# Altium schematic sheet Buttons.SchDoc
size A4; Subtitle: Subtitle; Project: Project; VersionRevision: VersionRevision; TotalSheet: TotalSheet; SheetNumber: 7; SheetTotal: 9
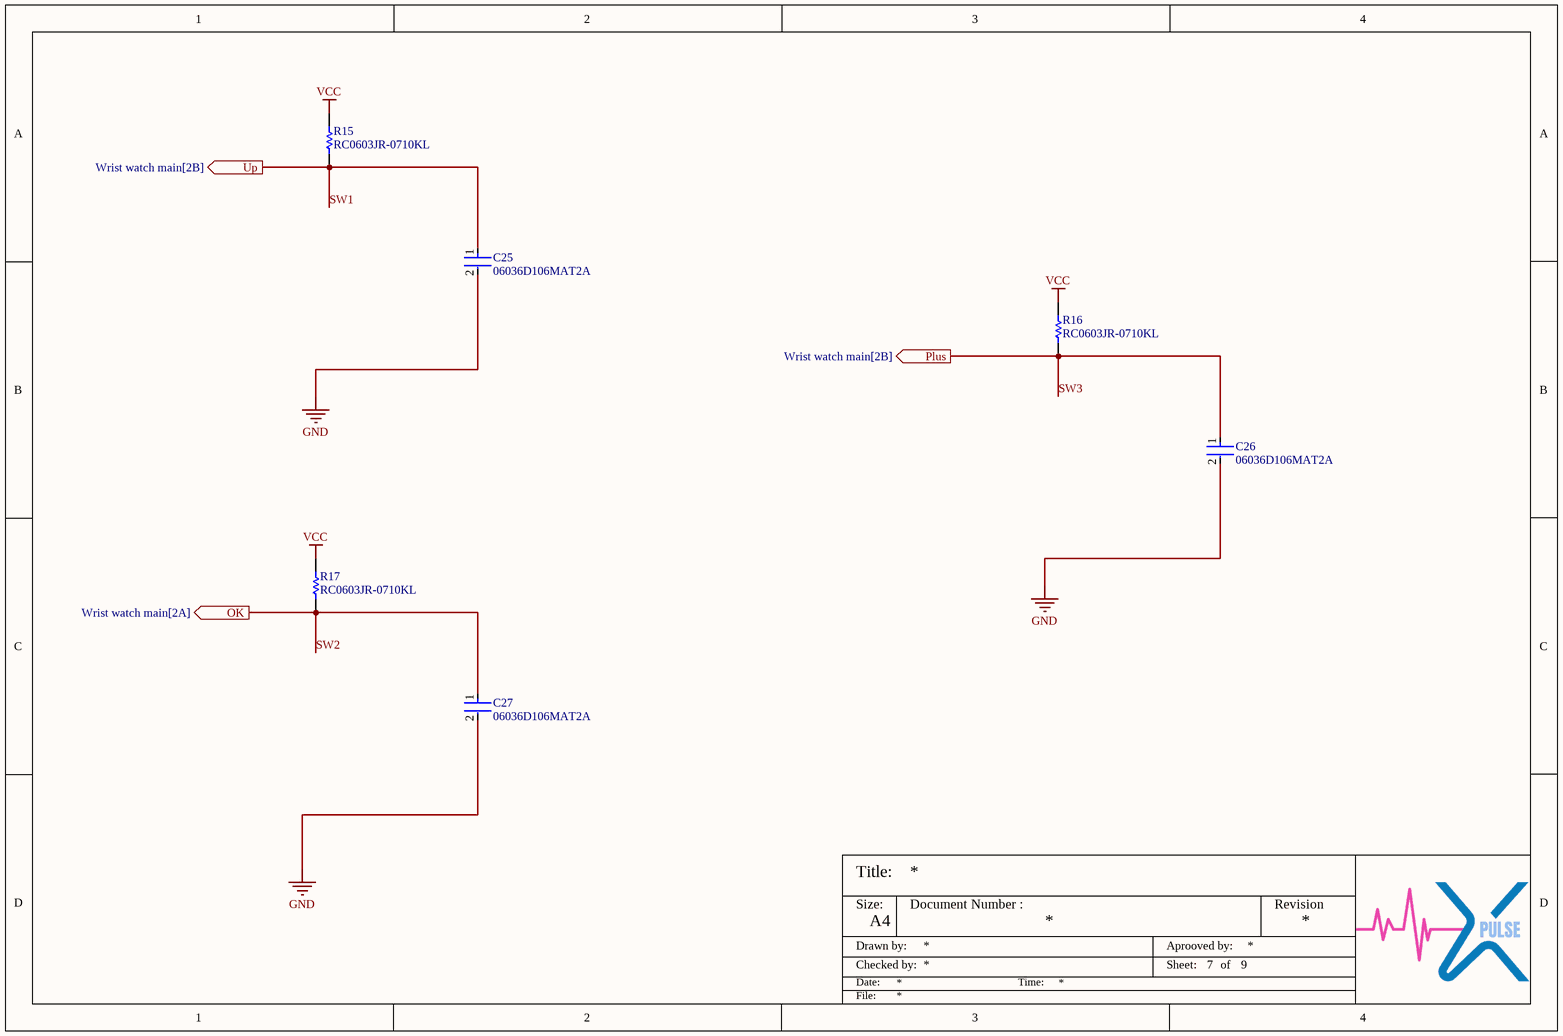
[diagram p0: Buttons.SchDoc]

## Parts
C25  06036D106MAT2A  [FP-0603-L_1_6_0_15-W_0_81-IPC_B]
C26  06036D106MAT2A  [FP-0603-L_1_6_0_15-W_0_81-IPC_B]
C27  06036D106MAT2A  [FP-0603-L_1_6_0_15-W_0_81-IPC_B]
R15  RC0603JR-0710KL  [RESC1608X55X25ML10T15]
R16  RC0603JR-0710KL  [RESC1608X55X25ML10T15]
R17  RC0603JR-0710KL  [RESC1608X55X25ML10T15]

## Ports
OK (out, see Wrist watch main[2A]), Plus (out, see Wrist watch main[2B]), Up (out, see Wrist watch main[2B])

## Nets
GND: C25.2 C26.2 C27.2
VCC: R15.2 R16.2 R17.2
SW1: C25.1 R15.1 ; port Up
SW2: C27.1 R17.1 ; port OK
SW3: C26.1 R16.1 ; port Plus

## Notes on the sheet
- Title:
- Size:
- Document Number :
- Revision
- Drawn by:
- Checked by:
- Date:
- A4
- Time:
- Aprooved by:
- Sheet:
- of
- File:

## Library data of the parts
C25-C27 = CMP-2006-04476-2: General Purpose Ceramic Capacitor, 0603, 10uF, 20%, X5R, 15%, 6.3V; RoHS Compliant: Yes; Case Code (Imperial): 0603; Construction: Flat; Thickness: 0.035inch; Height: 0.9mm; Number of Pins: 2; Max Operating Temperature: 85°C; Capacitance: 10uF; Length: 1.6mm; REACH SVHC: No SVHC; Width: 0.032inch; Voltage Rating (DC): 6.3V; Termination: SMD/SMT; Contact Plating: Tin; Min Operating Temperature: -55°C; Depth: 0.81mm; Packaging: Tape and Reel; Case Code (Metric): 1608; Voltage Rating: 6.3V; Lead Free: Lead Free; Mount: Surface Mount; Radiation Hardening: No; Series: -; Dielectric Material: Ceramic; Package Quantity: 1; Case/Package: 0603; Tolerance: 20%; Dielectric: X5R; Voltage: 6.3V
R15-R17 = CMP-2000-05022-1: Resistor, 10 KOhm, +/- 5%, 100 mW, -55 to 155 degC, 0603 (1608 Metric), RoHS, Tape and Reel; Manufacturer: Yageo; Resistance: 10kOhms; Voltage Rating: 50V; Temperature Coefficient: 100PPM/C; Power Rating: 100mW; Package Reference: 603; Series: RC; Case Code - mm: 1608; Packaging: Reel; Datasheet URL: http://www.farnell.com/datasheets/443971.pdf; Datasheet Version: Rev. 4, 04/2009; Operating Temperature Range: -55Cto+155C; Product: ThickFilmResistorsGeneralPurpose; Package Description: 2-Pin Surface Mount Device, Body 1.6 x 0.8 mm; Manufacturer URL: http://www.yageo.com/; Case Code - in: 0603; Tolerance: 5%; Termination Style: SMD/SMT